# Altium schematic sheet USB.SchDoc
size 420 x 297 mm; Address1: Address1; Address2: Address2; Address3: Address3; Address4: Address4; SheetNumber: 1; Scale: 1:1; Разраб.: Иванов; Обозначение документа: АБВГ.123456.001 Э3; Пров.: Петров; Утв.: Сидоров; Наименование организации: ОАО "Концерн "МПО-Гидроприбор"; Перв. применение: АБВГ.123456.000; Наименование изделия 1: Плата; Наименование изделия 2: Схема электрическая; Наименование изделия 3: принципиальная; Нач. отд.: Нач. отд.; Фамилия нач. отд.: Сидоров
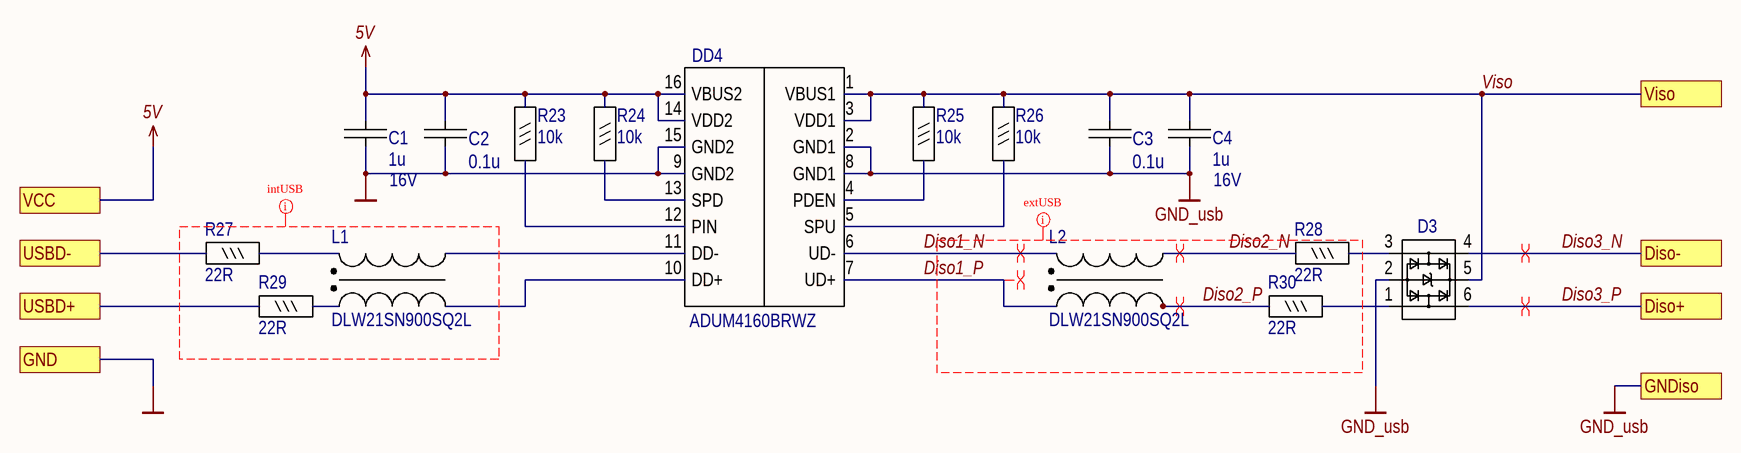
[diagram p0: USB.SchDoc]

## Parts
C1  1u  Voltage/Power: 16V  [C0603_IPC]
C2  0.1u  [C0603_IPC]
C3  0.1u  [C0603_IPC]
C4  1u  Voltage/Power: 16V  [C0603_IPC]
D3  USBLC6-2SC6  [sot23-6]  (value not drawn)
DD4  ADUM4160BRWZ  [SOIC16W]
L1  DLW21SN900SQ2L  [DLW21S 0805]
L2  DLW21SN900SQ2L  [DLW21S 0805]
R23  10k  [R0603]
R24  10k  [R0603]
R25  10k  [R0603]
R26  10k  [R0603]
R27  22R  [R0603]
R28  22R  [R0603]
R29  22R  [R0603]
R30  22R  [R0603]

## Ports
Diso+, Diso-, GND, GNDiso, USBD+, USBD-, VCC, Viso

## Nets
5V: C1.1 C2.1 DD4.14(VDD2) DD4.16(VBUS2) R23.2 R24.2 ; port VCC
GND: C1.2 C2.2 DD4.9(GND2) DD4.15(GND2) ; port GND
GND_usb: C3.2 C4.2 D3.2(GND) DD4.2(GND1) DD4.8(GND1) ; port GNDiso
Diso1_N: DD4.6(UD-) L2.1
Diso1_P: DD4.7(UD+) L2.4
Diso2_N: L2.2 R28.1
Diso2_P: L2.3 R30.1
Diso3_N: D3.4(IO2) ; port Diso-
Diso3_P: D3.6(IO1) ; port Diso+
USBD+: R29.1 ; port USBD+
USBD-: R27.1 ; port USBD-
Viso: C3.1 C4.1 D3.5(Vbus) DD4.1(VBUS1) DD4.3(VDD1) R25.2 R26.2 ; port Viso
NetD3_1: D3.1(IO1) R30.2
NetD3_3: D3.3(IO2) R28.2
NetDD4_4: DD4.4(PDEN) R25.1
NetDD4_5: DD4.5(SPU) R26.1
NetDD4_10: DD4.10(DD+) L1.3
NetDD4_11: DD4.11(DD-) L1.2
NetDD4_12: DD4.12(PIN) R23.1
NetDD4_13: DD4.13(SPD) R24.1
NetL1_1: L1.1 R27.2
NetL1_4: L1.4 R29.2

## Layout directives
differential pair: Diso1_N, Diso1_P, Diso2_N, Diso2_P, Diso3_N, Diso3_P
net class intUSB; rule Differential Pairs Routing [Pref Gap = 0.254mm    Min Gap  = 0.2mm    Max Gap  = 0.3mmPref Width = 0.254mm    Min Width  = 0.2mm    Max Width  = 0.254mm]; rule Matched Net Lengths [Tolerance = 1mm]: (no net found under the mark)
net class extUSB; rule Differential Pairs Routing [Pref Gap = 0.254mm    Min Gap  = 0.2mm    Max Gap  = 0.3mmPref Width = 0.254mm    Min Width  = 0.2mm    Max Width  = 0.254mm]; rule Matched Net Lengths [Tolerance = 1mm]: Diso2_N, Diso2_P

## Notes on the sheet
- Подп. и дата
- Инв. № дубл.
- Взам. инв. №
- Инв. № подл.
- Изм.
- Лист
- № докум.
- Подп.
- Дата
- Копировал
- Формат А3

## Library data of the parts
C1 C4 = 1u 16V: 1µF ±10% 16V Ceramic Capacitor X7R 0603 (1608 Metric); MPN: CC0603KRX7R7BB105; Manufacturer: Yageo; Name: 1u 16V; Tolerance: 0,1; LibraryPath: _library\sch\cap.schlib; FootprintPath: _library\pcb\capSmd.pcblib; ComponentLink2URL: https://www.digikey.com/product-detail/en/yageo/CC0603KRX7R9BB104/311-1344-2-ND/2103082; ComponentLink2Description: site; Type: X7R; price elitan 1000pc: 0.97; price terra 1000pc: 2.5; Value: 1u
C2 C3 = 0.1u 50V: 0.1uF ±10% 50V Ceramic Capacitor X7R 0603 (1608 Metric); MPN: CL10B104KB8NNND; Manufacturer: Samsung; Tolerance: 0,1; PartNumber: 0.1u 50V; Value: 0.1u; Voltage/Power: 50V; LibraryPath: _library\sch\cap.schlib; FootprintPath: _library\pcb\capSmd.pcblib; ComponentLink2URL: https://www.digikey.com/product-detail/en/yageo/CC0603KRX7R9BB104/311-1344-2-ND/2103082; ComponentLink2Description: site; Type: X7R; price elitan 1000pc: 0.63; price terra 1000pc: 0.65
D3 = USBLC6-2SC6: TVS DIODE 5.25V 17V SOT23-6; Component Package: SOT23-6L; Component Name: USBLC6-2SC6; HelpURL: C:\DATASHEET\Diode\usblc6-2.pdf; Name: USBLC6-2SC6; MPN: USBLC6-2SC6; Voltage/Power: 5.25V 17V; ComponentLink2URL: https://www.st.com/content/ccc/resource/technical/document/datasheet/06/1d/48/9c/6c/20/4a/b2/CD00050750.pdf/files/CD00050750.pdf/jcr:content/translations/en.CD00050750.pdf; ComponentLink2Description: site; FootprintPath: pcb\diods.pcblib; ComponentLink3URL: D:\_library\pdf\diods\BAS70_BAS170SERIES-DS-v01_01-en.pdf; ComponentLink3Description: datasheet; ComponentLink4URL: http://www.diodes.com/?q=catalog/Schottky___SBR_Rectifiers_6/B560C_4305; ComponentLink4Description: site
DD4 = ADUM4160BRWZ: Digital isolator; 3.1Г·5.5VDC; Interface: USB; SMD; SO16; MPN: ADUM4160BRWZ
L1 L2 = DLW21SN_SQ: CMC 330MA 2LN 90 OHM SMD; Value: 100u; Name: DLW21SN_SQ; MPN: DLW21SN900SQ2L; LibraryPath: _library\sch\inductors.schlib; FootprintPath: _library\pcb\inductor.pcblib; ComponentLink1URL: D:\_library\pdf\inductor\sinphase\dlp11sn900sl2l.pdf; ComponentLink1Description: datasheet; ComponentLink2URL: https://www.murata.com/en-us/products/productdata/8796757917726/EFLC0003.pdf; ComponentLink2Description: site; ComponentLink3URL: D:\_library\pdf\inductor\sinphase\tdk-mcz2010ah900_ed20b2fa0b.pdf; ComponentLink3Description: TDK; ComponentLink4URL: D:\_library\pdf\inductor\sinphase\tdk-mcz2010ah900_ed20b2fa0b.pdf
R23-R26 = 10k 5%: 10 kOhms ±5% 0.1W, 1/10W Chip Resistor 0603 (1608 Metric) Moisture Resistant Thick Film; MPN: RC0603JR-0710kL; Manufacturer: yageo; Name: 10k 5%; Voltage/Power: 0.063; Value: 10k; Tolerance: 5%; ComponentLink2URL: https://www.digikey.com/product-detail/en/yageo/RC0603JR-0710KL/311-10KGRTR-ND/726700; ComponentLink2Description: site; price elitan 1000pc: 0.17; price terra 1000pc: 0.15; LibraryPath: sch\res.schlib; FootprintPath: pcb\resSmd.pcblib
R27-R30 = 22R 5%: 22 Ohms ±5% 0.1W, 1/10W Chip Resistor 0603 (1608 Metric) Moisture Resistant Thick Film; MPN: RC0603JR-0722RL; Manufacturer: yageo; Name: 22R 5%; Voltage/Power: 0.063; Value: 22R; Tolerance: 5%; ComponentLink2URL: https://www.digikey.com/product-detail/en/yageo/RC0603JR-0722RL/311-22GRTR-ND/726743; ComponentLink2Description: site; price elitan 1000pc: 0.26; price terra 1000pc: 0.23; LibraryPath: sch\res.schlib; FootprintPath: pcb\resSmd.pcblib